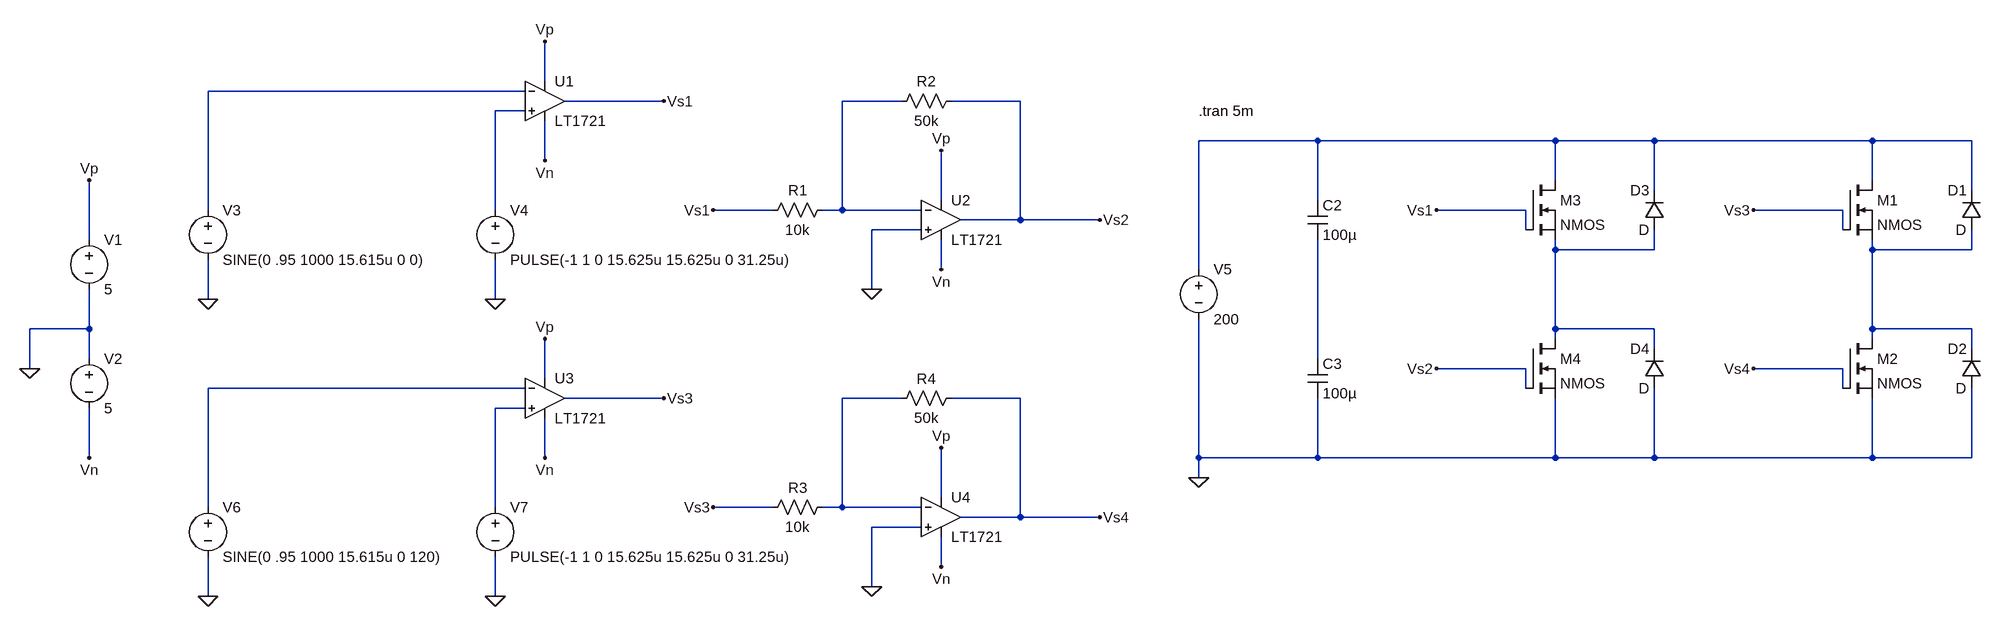
[diagram p0: schematic Full-Bridge Single Phase.asc]
Full-Bridge Single Phase.asc, the LTspice schematic file:
Version 4.1
SHEET 1 3188 680
WIRE 864 -192 864 -256
WIRE 832 -176 320 -176
WIRE 1056 -160 896 -160
WIRE 1440 -160 1344 -160
WIRE 1632 -160 1520 -160
WIRE 832 -144 784 -144
WIRE 2112 -96 1920 -96
WIRE 2496 -96 2112 -96
WIRE 2656 -96 2496 -96
WIRE 3008 -96 2656 -96
WIRE 3168 -96 3008 -96
WIRE 864 -64 864 -128
WIRE 2496 -32 2496 -96
WIRE 3008 -32 3008 -96
WIRE 2656 -16 2656 -96
WIRE 3168 -16 3168 -96
WIRE 1504 0 1504 -80
WIRE 2112 0 2112 -96
WIRE 320 16 320 -176
WIRE 784 16 784 -144
WIRE 1232 16 1136 16
WIRE 1344 16 1344 -160
WIRE 1344 16 1312 16
WIRE 1472 16 1344 16
WIRE 2448 16 2304 16
WIRE 2960 16 2816 16
WIRE 1632 32 1632 -160
WIRE 1632 32 1536 32
WIRE 1760 32 1632 32
WIRE 1472 48 1392 48
WIRE 2448 48 2448 16
WIRE 2960 48 2960 16
WIRE 128 64 128 -32
WIRE 2496 80 2496 64
WIRE 2656 80 2656 48
WIRE 2656 80 2496 80
WIRE 3008 80 3008 64
WIRE 3168 80 3168 48
WIRE 3168 80 3008 80
WIRE 1504 112 1504 64
WIRE 1920 112 1920 -96
WIRE 1392 144 1392 48
WIRE 320 160 320 96
WIRE 784 160 784 96
WIRE 128 208 128 144
WIRE 128 208 32 208
WIRE 2496 208 2496 80
WIRE 2656 208 2496 208
WIRE 3008 208 3008 80
WIRE 3168 208 3008 208
WIRE 2496 224 2496 208
WIRE 3008 224 3008 208
WIRE 2656 240 2656 208
WIRE 3168 240 3168 208
WIRE 128 256 128 208
WIRE 2112 256 2112 64
WIRE 32 272 32 208
WIRE 2448 272 2304 272
WIRE 2960 272 2816 272
WIRE 864 288 864 224
WIRE 832 304 320 304
WIRE 2448 304 2448 272
WIRE 2960 304 2960 272
WIRE 1056 320 896 320
WIRE 1440 320 1344 320
WIRE 1632 320 1520 320
WIRE 832 336 784 336
WIRE 128 416 128 336
WIRE 864 416 864 352
WIRE 1920 416 1920 192
WIRE 2112 416 2112 320
WIRE 2112 416 1920 416
WIRE 2496 416 2496 320
WIRE 2496 416 2112 416
WIRE 2656 416 2656 304
WIRE 2656 416 2496 416
WIRE 3008 416 3008 320
WIRE 3008 416 2656 416
WIRE 3168 416 3168 304
WIRE 3168 416 3008 416
WIRE 1920 448 1920 416
WIRE 1504 480 1504 400
WIRE 320 496 320 304
WIRE 784 496 784 336
WIRE 1232 496 1136 496
WIRE 1344 496 1344 320
WIRE 1344 496 1312 496
WIRE 1472 496 1344 496
WIRE 1632 512 1632 320
WIRE 1632 512 1536 512
WIRE 1760 512 1632 512
WIRE 1472 528 1392 528
WIRE 1504 592 1504 544
WIRE 1392 624 1392 528
WIRE 320 640 320 576
WIRE 784 640 784 576
FLAG 32 272 0
FLAG 128 -32 Vp
FLAG 128 416 Vn
FLAG 320 160 0
FLAG 784 160 0
FLAG 864 -256 Vp
FLAG 864 -64 Vn
FLAG 1504 -80 Vp
FLAG 1504 112 Vn
FLAG 1760 32 Vs2
FLAG 1392 144 0
FLAG 1056 -160 Vs1
FLAG 1136 16 Vs1
FLAG 1920 448 0
FLAG 2816 16 Vs3
FLAG 2816 272 Vs4
FLAG 2304 16 Vs1
FLAG 2304 272 Vs2
FLAG 320 640 0
FLAG 784 640 0
FLAG 864 224 Vp
FLAG 864 416 Vn
FLAG 1504 400 Vp
FLAG 1504 592 Vn
FLAG 1760 512 Vs4
FLAG 1392 624 0
FLAG 1056 320 Vs3
FLAG 1136 496 Vs3
SYMBOL voltage 128 48 R0
WINDOW 123 0 0 Left 0
WINDOW 39 0 0 Left 0
SYMATTR InstName V1
SYMATTR Value 5
SYMBOL voltage 128 240 R0
WINDOW 123 0 0 Left 0
WINDOW 39 0 0 Left 0
SYMATTR InstName V2
SYMATTR Value 5
SYMBOL Comparators\\LT1721 864 -224 R0
SYMATTR InstName U1
SYMBOL Comparators\\LT1721 1504 -32 R0
SYMATTR InstName U2
SYMBOL voltage 320 0 R0
WINDOW 123 0 0 Left 0
WINDOW 39 0 0 Left 0
SYMATTR InstName V3
SYMATTR Value SINE(0 .95 1000 15.615u 0 0)
SYMBOL voltage 784 0 R0
WINDOW 123 0 0 Left 0
WINDOW 39 0 0 Left 0
SYMATTR InstName V4
SYMATTR Value PULSE(-1 1 0 15.625u 15.625u 0 31.25u)
SYMBOL res 1328 0 R90
WINDOW 0 0 56 VBottom 2
WINDOW 3 32 56 VTop 2
SYMATTR InstName R1
SYMATTR Value 10k
SYMBOL res 1536 -176 R90
WINDOW 0 0 56 VBottom 2
WINDOW 3 32 56 VTop 2
SYMATTR InstName R2
SYMATTR Value 50k
SYMBOL voltage 1920 96 R0
WINDOW 123 0 0 Left 0
WINDOW 39 0 0 Left 0
SYMATTR InstName V5
SYMATTR Value 200
SYMBOL cap 2096 0 R0
SYMATTR InstName C2
SYMATTR Value 100µ
SYMBOL cap 2096 256 R0
SYMATTR InstName C3
SYMATTR Value 100µ
SYMBOL nmos 2960 -32 R0
SYMATTR InstName M1
SYMBOL nmos 2960 224 R0
SYMATTR InstName M2
SYMBOL diode 3184 48 R180
WINDOW 0 24 64 Left 2
WINDOW 3 24 0 Left 2
SYMATTR InstName D1
SYMBOL diode 3184 304 R180
WINDOW 0 24 64 Left 2
WINDOW 3 24 0 Left 2
SYMATTR InstName D2
SYMBOL nmos 2448 -32 R0
SYMATTR InstName M3
SYMBOL nmos 2448 224 R0
SYMATTR InstName M4
SYMBOL diode 2672 48 R180
WINDOW 0 24 64 Left 2
WINDOW 3 24 0 Left 2
SYMATTR InstName D3
SYMBOL diode 2672 304 R180
WINDOW 0 24 64 Left 2
WINDOW 3 24 0 Left 2
SYMATTR InstName D4
SYMBOL Comparators\\LT1721 864 256 R0
SYMATTR InstName U3
SYMBOL Comparators\\LT1721 1504 448 R0
SYMATTR InstName U4
SYMBOL voltage 320 480 R0
WINDOW 123 0 0 Left 0
WINDOW 39 0 0 Left 0
SYMATTR InstName V6
SYMATTR Value SINE(0 .95 1000 15.615u 0 120)
SYMBOL voltage 784 480 R0
WINDOW 123 0 0 Left 0
WINDOW 39 0 0 Left 0
SYMATTR InstName V7
SYMATTR Value PULSE(-1 1 0 15.625u 15.625u 0 31.25u)
SYMBOL res 1328 480 R90
WINDOW 0 0 56 VBottom 2
WINDOW 3 32 56 VTop 2
SYMATTR InstName R3
SYMATTR Value 10k
SYMBOL res 1536 304 R90
WINDOW 0 0 56 VBottom 2
WINDOW 3 32 56 VTop 2
SYMATTR InstName R4
SYMATTR Value 50k
TEXT 1920 -144 Left 2 !.tran 5m

The netlist it stands for:
* Full-Bridge Single Phase.asc
V1 Vp 0 5
V2 0 Vn 5
X§U1 N003 N001 Vp Vn Vs1 LT1720  ; LT1721, pins In+ In- V+ V- OUT
X§U2 0 N002 Vp Vn Vs2 LT1720  ; LT1721, pins In+ In- V+ V- OUT
V3 N001 0 SINE(0 .95 1000 15.615u 0 0)
V4 N003 0 PULSE(-1 1 0 15.625u 15.625u 0 31.25u)
R1 N002 Vs1 10k
R2 Vs2 N002 50k
V5 N004 0 200
C2 N004 N007 100µ
C3 N007 0 100µ
M1 N004 Vs3 N006 N006 NMOS
M2 N006 Vs4 0 0 NMOS
D1 N006 N004 D
D2 0 N006 D
M3 N004 Vs1 N005 N005 NMOS
M4 N005 Vs2 0 0 NMOS
D3 N005 N004 D
D4 0 N005 D
X§U3 N010 N008 Vp Vn Vs3 LT1720  ; LT1721, pins In+ In- V+ V- OUT
X§U4 0 N009 Vp Vn Vs4 LT1720  ; LT1721, pins In+ In- V+ V- OUT
V6 N008 0 SINE(0 .95 1000 15.615u 0 120)
V7 N010 0 PULSE(-1 1 0 15.625u 15.625u 0 31.25u)
R3 N009 Vs3 10k
R4 Vs4 N009 50k
.model D D
.lib standard.dio
.model NMOS NMOS
.model PMOS PMOS
.lib standard.mos
.tran 5m
.lib LTC.lib
.backanno
.end